# Altium project USB-TTL Converter.PrjPcb
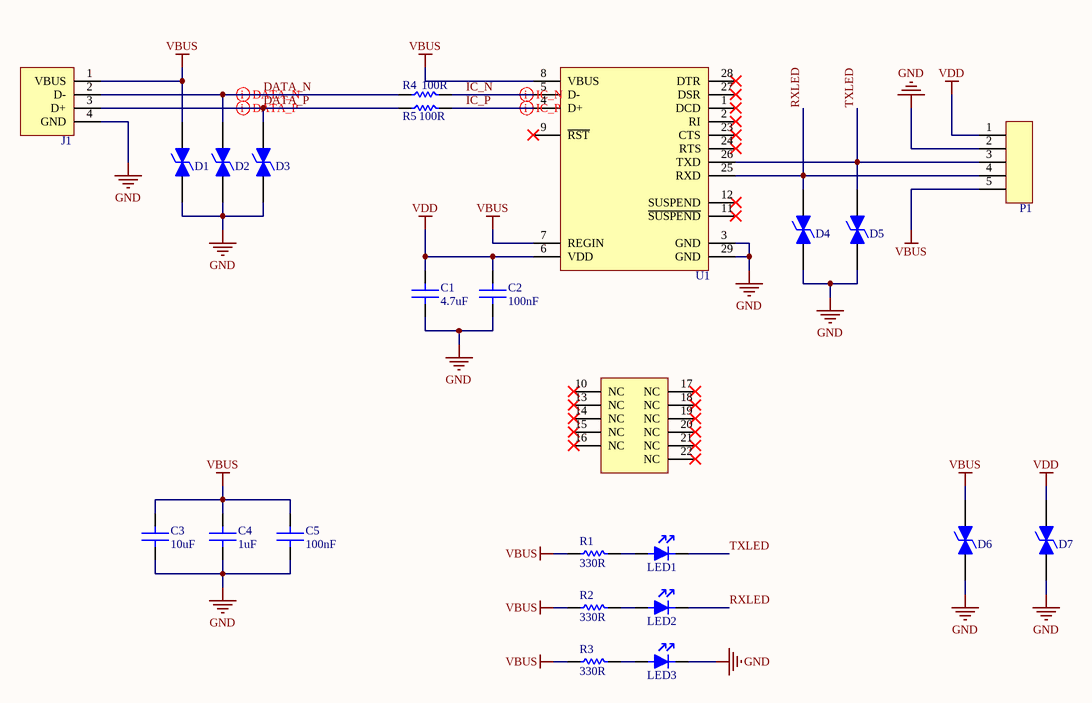
[diagram p0: USB-TTL Converter.SchDoc]
1 sheet, 23 parts. Net scope: global (net labels, ports and power ports of the same name join across sheets).
Board file: UBS-TTL Converter.PcbDoc

## Sheet USB-TTL Converter.SchDoc
size A3; SheetNumber: 1; SheetTotal: 1

### Parts
C1  value 4.7uF  [CAP 0402]  (hidden comment: LMK105BBJ475MVLF)
C2  value 100nF  [CAP 0402]  (hidden comment: C0402C104K4RACTU)
C3  value 10uF  [CAP 0603]  (hidden comment: CL10A106MP8NNNC)
C4  value 1uF  [CAP 0402]  (hidden comment: C0402X5R100-105MNE)
C5  value 100nF  [CAP 0402]  (hidden comment: C0402C104K4RACTU)
D1  TPD1E10B06DPYR  [TVS DIODE]  (value not drawn)
D2  TPD1E10B06DPYR  [TVS DIODE]  (value not drawn)
D3  TPD1E10B06DPYR  [TVS DIODE]  (value not drawn)
D4  TPD1E10B06DPYR  [TVS DIODE]  (value not drawn)
D5  TPD1E10B06DPYR  [TVS DIODE]  (value not drawn)
D6  TPD1E10B06DPYR  [TVS DIODE]  (value not drawn)
D7  TPD1E10B06DPYR  [TVS DIODE]  (value not drawn)
J1  629004113921  [USB TYPE-A]  (value not drawn)
LED1  150080VS75000  [LED 0805]  (value not drawn)
LED2  150080VS75000  [LED 0805]  (value not drawn)
LED3  150080VS75000  [LED 0805]  (value not drawn)
P1  61300511021  [CONNECTOR]  (value not drawn)
R1  value 330R  [RES 0603]  (hidden comment: CRGH0603F330R)
R2  value 330R  [RES 0603]  (hidden comment: CRGH0603F330R)
R3  value 330R  [RES 0603]  (hidden comment: CRGH0603F330R)
R4  value 100R  [RES 0603]  (hidden comment: RC0603FR-7W100RL)
R5  value 100R  [RES 0603]  (hidden comment: RC0603FR-7W100RL)
U1  CP2102-GM  [QFN-28]  (value not drawn)

### Nets
GND: C1.1 C2.1 C3.1 C4.1 C5.1 D1.1 D2.1 D3.1 D4.1 D5.1 D6.1 D7.1 J1.4(GND) LED3.2 P1.2 U1.3(GND) U1.29(GND)
VBUS: C3.2 C4.2 C5.2 D1.2 D6.2 J1.1(VBUS) P1.5 R1.1 R2.1 R3.1 U1.7(REGIN) U1.8(VBUS)
VDD: C1.2 C2.2 D7.2 P1.1 U1.6(VDD)
DATA_N: D2.2 J1.2(D-) R4.1
DATA_P: D3.2 J1.3(D+) R5.1
IC_N: R4.2 U1.5(D-)
IC_P: R5.2 U1.4(D+)
RXLED: D4.2 LED2.2 P1.4 U1.25(RXD)
TXLED: D5.2 LED1.2 P1.3 U1.26(TXD)
NetLED1_1: LED1.1 R1.2
NetLED2_1: LED2.1 R2.2
NetLED3_1: LED3.1 R3.2

Not connected (* = marked no-connect by the designer): U1 1(DCD)* 2(RI)* 9(~{RST})* 10(NC)* 11(~{SUSPEND})* 12(SUSPEND)* 13(NC)* 14(NC)* 15(NC)* 16(NC)* 17(NC)* 18(NC)* 19(NC)* 20(NC)* 21(NC)* 22(NC)* 23(CTS)* 24(RTS)* 27(DSR)* 28(DTR)*

### Layout directives
differential pair: DATA_N, IC_N, IC_P

### Notes on the sheet
- Dosya Adı / File Name
- Hazırlayan / Prepared By
- Tanım / Description
- Değiştirme Tarihi / Changed Date
- Bölüm / Department
- Onaylayan / Approved By
- Kontrol Eden / Checked By
- Boyut / Size
- Sayfa / Sheet
- Revizyon / Revision

### Library data of the parts
C1 = CAP CER 4.7UF 0402: CAP CER 4.7UF 10V X5R 0402
C2 C5 = CAP CER 100NF 0402: CAP CER 0.1UF 16V X7R 0402
C3 = CAP CER 10UF 0603: CAP CER 10UF 10V X5R 0603
C4 = CAP CER 1UF 0402: CAP CER 1UF 10V X5R 0402
D1-D7 = TVS DIODE SMD: TVS DIODE 5.5VWM 14VC 2X1SON
J1 = CONN USB2.0 TYPE-A: CONN USB2.0 TYPEA 4P SMD RA
LED1 LED2 = GREEN LED 0805: LED GREEN 0805 SMD
LED3 = RED LED 0805: LED GREEN 0805 SMD
P1 = CONN HEADER 5POS: CONN HEADER R/A 5POS 2.54MM
R1-R3 = RES 330 OHM 0603: RES 330 OHM 1% 1/5W 0603
R4 R5 = RES 100 OHM 0603: RES 100 OHM 1% 1/5W 0603
U1 = CP2102 SMD: IC USB-TO-UART BRIDGE 28VQFN